# EAGLE design hand amptrol ver4 (EAGLE 7.1.0)
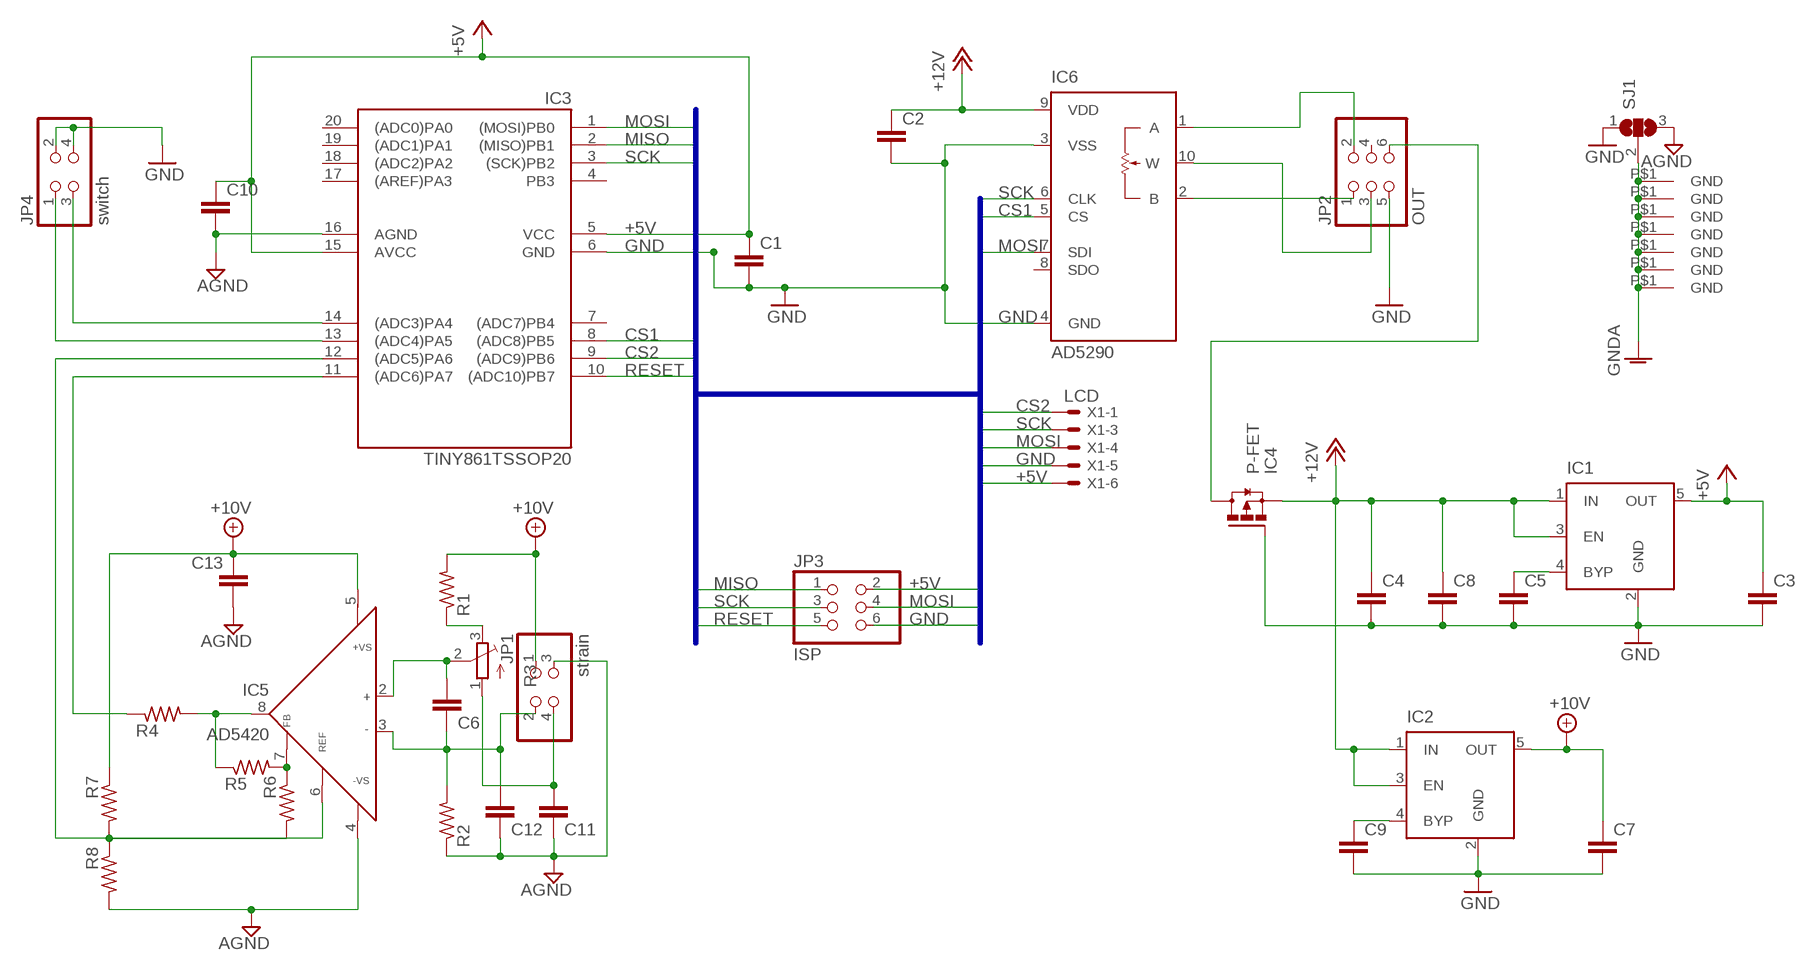
[diagram p0: schematic, sheet 1]

## Parts
C1  C-EUC0603  [C0603]
C2  C-EUC0603  [C0603]
C3  C-EUC0603  [C0603]
C4  C-EUC1206  [C1206]
C5  C-EUC0603  [C0603]
C6  C-EUC0603  [C0603]
C7  C-EUC0603  [C0603]
C8  C-EUC0603  [C0603]
C9  C-EUC0603  [C0603]
C10  C-EUC0603  [C0603]
C11  C-EUC0603  [C0603]
C12  C-EUC0603  [C0603]
C13  C-EUC0603  [C0603]
IC1  MIC5219XX  [SOT23-5]
IC2  MIC5219XX  [SOT23-5]
IC3  TINY861TSSOP20  [TSSOP20]
IC4  P-FET  [SOT23]
IC5  AD5420  [MSOP08]
IC6  AD5290  [MSOP10]
JP1  strain  PINHD-2X2  [2X02]
JP2  OUT  PINHD-2X3  [2X03]
JP3  ISP  PINHD-2X3  [2X03]
JP4  switch  PINHD-2X2  [2X02]
R1  R-US_R0603  [R0603]
R2  R-US_R0603  [R0603]
R3  TRIM_EU-3223W  [3223W]
R4  R-US_R0603  [R0603]
R5  R-US_R0603  [R0603]
R6  R-US_R0603  [R0603]
R7  R-US_R0603  [R0603]
R8  R-US_R0603  [R0603]
SJ1  SJ2W  [SJ_2]
U$5  GRDSMALL  [GNDSMALL]
U$6  GRDSMALL  [GNDSMALL]
U$7  GRDSMALL  [GNDSMALL]
U$8  GRDSMALL  [GNDSMALL]
U$9  GRDSMALL  [GNDSMALL]
U$10  GRDSMALL  [GNDSMALL]
U$11  GRDSMALL  [GNDSMALL]
X1  LCD  22-23-2061  [22-23-2061]

## Nets
+5V: C1.1 C3.1 C10.1 IC1.5(OUT) IC3.5(VCC) IC3.15(AVCC) JP3.2 X1.6
+10V: C7.1 C13.1 IC2.5(OUT) IC5.5(+VS) JP1.1 R1.2 R7.1
+12V: C2.1 C4.1 C8.1 IC1.1(IN) IC1.3(EN) IC2.1(IN) IC2.3(EN) IC4.2(S) IC6.9(VDD)
+12VIN: IC4.3(D) JP2.6
AGND: C10.2 C11.1 C12.1 C13.2 IC3.16(AGND) IC5.4(-VS) JP1.3 R2.1 R8.2 SJ1.3
CS1: IC3.8((ADC8)PB5) IC6.5(CS)
CS2: IC3.9((ADC9)PB6) X1.1
GND: C1.2 C2.2 C3.2 C4.2 C5.2 C7.2 C8.2 C9.2 IC1.2(GND) IC2.2(GND) IC3.6(GND) IC4.1(G) IC6.3(VSS) IC6.4(GND) JP2.5 JP3.6 JP4.2 JP4.4 SJ1.1 X1.5
GNDA: SJ1.2 U$5.P$1(GND) U$6.P$1(GND) U$7.P$1(GND) U$8.P$1(GND) U$9.P$1(GND) U$10.P$1(GND) U$11.P$1(GND)
MISO: IC3.2((MISO)PB1) JP3.1
MOSI: IC3.1((MOSI)PB0) IC6.7(SDI) JP3.4 X1.4
N$1: R1.1 R3.3(E)
N$2: IC3.11((ADC6)PA7) R4.1
N$3: IC6.2(B) JP2.1
N$4: C5.1 IC1.4(BYP)
N$5: C9.1 IC2.4(BYP)
N$6: IC3.13((ADC4)PA5) JP4.1
N$7: IC6.1(A) JP2.2
N$9: IC6.10(W) JP2.3
N$10: C6.2 IC5.2(IN+) R3.2(S)
N$11: IC3.14((ADC3)PA4) JP4.3
N$15: IC5.8(OUT) R4.2 R5.1
N$17: IC5.7(FB) R5.2 R6.1
N$18: IC3.12((ADC5)PA6) IC5.6(REF) R6.2 R7.2 R8.1
RESET: IC3.10((ADC10)PB7) JP3.5
SCK: IC3.3((SCK)PB2) IC6.6(CLK) JP3.3 X1.3
STRAIN+: C6.1 C12.2 IC5.3(IN-) JP1.2 R2.2
STRAIN-: C11.2 JP1.4 R3.1(A)
Unconnected: IC3.4(PB3) IC3.7((ADC7)PB4) IC3.17((AREF)PA3) IC3.18((ADC2)PA2) IC3.19((ADC1)PA1) IC3.20((ADC0)PA0) IC6.8(SDO) JP2.4 X1.2

## Buses
ISP:MOSI,MISO,SCK,RESET,+5V,GND,CS1,CS2

## Library data of the parts
C1-C13 = resistor:C-EU: CAPACITOR, European symbol; SPICEPREFIX: C
IC1 IC2 = v-reg-micrel:MIC5219XX: VOLTAGE REGULATOR; OC_FARNELL: unknown; OC_NEWARK: unknown
IC3 = atmel:TINY861
IC4 = transistor-power:P-FET
IC5 = analog-devices:AD5420
IC6 = analog-devices:AD5290
JP1 JP4 = pinhead:PINHD-2X2: PIN HEADER
JP2 JP3 = pinhead:PINHD-2X3: PIN HEADER
R1 R2 R4-R8 = resistor:R-US_: RESISTOR, American symbol
R3 = pot:TRIM_EU-: POTENTIOMETER
SJ1 = jumper:SJ2W: SMD solder JUMPER
U$5-U$11 = jumper:GRDSMALL
X1 = con-molex:22-23-2061: .100" (2.54mm) Center Header - 6 Pin; MF: MOLEX; MPN: 22-23-2061; OC_FARNELL: 1462922; OC_NEWARK: 27C1933

## Board
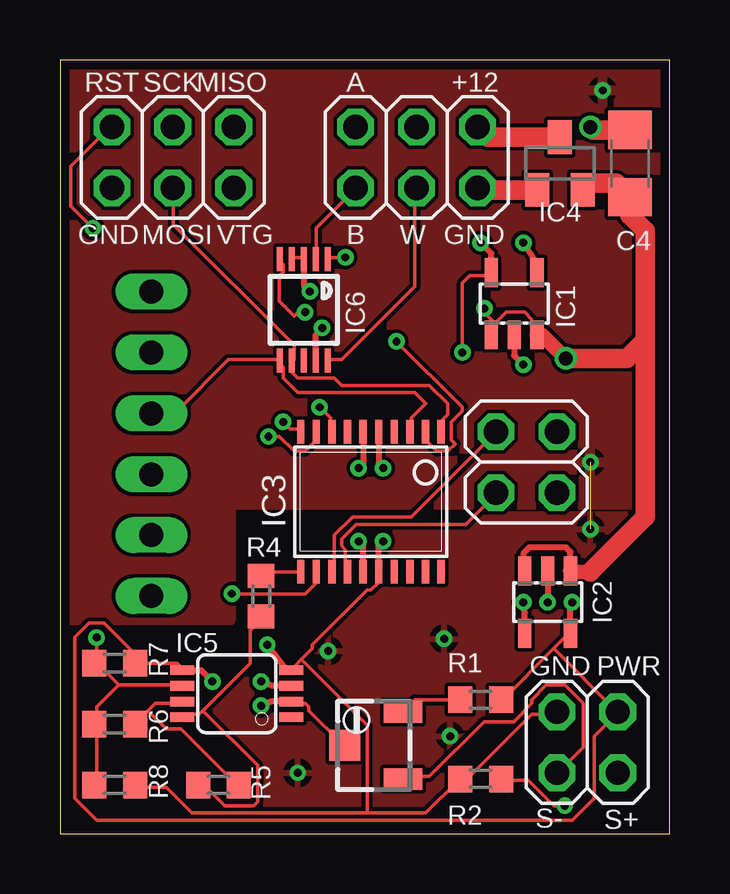
[diagram p1: board, top side]
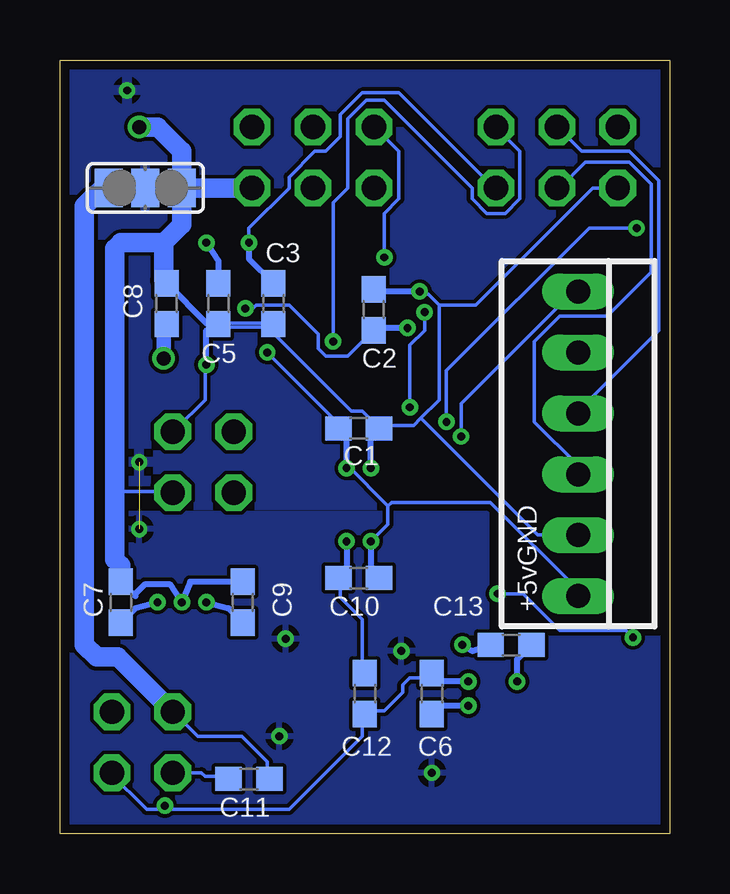
[diagram p2: board, bottom side, seen from below]

Size 25.4 x 32.26 mm. Coordinates in mm from the lower left corner, seen from the top.
Outline: 0,0 25.4,0 25.4,32.26 0,32.26 0,0
Copper layers (1*16): Top 0.0356mm / dielectric 1.5011mm / Bottom 0.0356mm
Design rules "LaenPCBOrder": minimum track width 6mil, minimum drill 13mil, track to track 6mil, track to pad 6mil, pad to pad 6mil, via to via 6mil, smd to smd 6mil, copper to edge 15mil, drill to drill 6mil, minimum pad ring 7mil, minimum via ring 7mil, stop-mask expansion 3mil, vias tented up to drill 0mil, thermal gap 10mil

### Footprints (pad centres in the part's own frame; a part is rotated, then mirrored left to right if it is on the bottom)
C0603 = smd 1.1 x 1: 1 -0.85,0; 2 0.85,0
C1206 = smd 1.6 x 1.8: 1 -1.4,0; 2 1.4,0
SOT23-5 = smd 0.55 x 1.2: 1 -0.95,-1.3; 2 0,-1.3; 3 0.95,-1.3; 4 0.95,1.3; 5 -0.95,1.3
TSSOP20 = smd 0.305 x 0.991: 1 -2.925,-2.918; 2 -2.275,-2.918; 3 -1.625,-2.918; 4 -0.975,-2.918; 5 -0.325,-2.918; 6 0.325,-2.918; 7 0.975,-2.918; 8 1.625,-2.918; 9 2.275,-2.918; 10 2.925,-2.918; 11 2.925,2.918; 12 2.275,2.918; 13 1.625,2.918; 14 0.975,2.918; 15 0.325,2.918; 16 -0.325,2.918; 17 -0.975,2.918; 18 -1.625,2.918; 19 -2.275,2.918; 20 -2.925,2.918
SOT23 = smd 1 x 1.4: 1 -0.95,-1.1; 2 0.95,-1.1; 3 0,1.1
MSOP08 = smd 0.4 x 1: 1 -0.976,-2.263; 2 -0.326,-2.263; 3 0.324,-2.263; 4 0.974,-2.263; 5 0.974,2.262; 6 0.324,2.262; 7 -0.326,2.262; 8 -0.976,2.262
MSOP10 = smd 0.25 x 1: 1 -1,-2.113; 2 -0.5,-2.113; 3 0,-2.113; 4 0.5,-2.113; 5 1,-2.113; 6 1,2.113; 7 0.5,2.113; 8 0,2.113; 9 -0.5,2.113; 10 -1,2.113
2X02 = drill 1.016 octagon: 1 -1.27,-1.27; 2 -1.27,1.27; 3 1.27,-1.27; 4 1.27,1.27
2X03 = drill 1.016 octagon: 1 -2.54,-1.27; 2 -2.54,1.27; 3 0,-1.27; 4 0,1.27; 5 2.54,-1.27; 6 2.54,1.27
R0603 = smd 1 x 1.1: 1 -0.85,0; 2 0.85,0
3223W = smd 0.9 x 1.6: 1 -1.4,-1.215; 3 1.4,-1.215 | smd 1.3 x 1.3: 2 0,1.215
SJ_2 = smd 1.168 x 1.6: 1 -1.524,0; 2 0,0; 3 1.524,0
GNDSMALL = drill 0.33 pad 0.508: P$1 0,0
22-23-2061 = drill 1 long: 1 -6.35,0; 2 -3.81,0; 3 -1.27,0; 4 1.27,0; 5 3.81,0; 6 6.35,0

### Placement (x,y rotation side)
C1  12.95,16.89 0 bottom
C2  12.32,21.84 90 bottom
C3  16.51,22.1 270 bottom
C4  23.75,27.94 90 top
C5  18.8,22.1 270 bottom
C6  9.91,5.84 270 bottom
C7  22.86,9.65 90 bottom
C8  20.95,22.1 90 bottom
C9  17.78,9.65 90 bottom
C10  12.95,10.67 180 bottom
C11  17.53,2.29 180 bottom
C12  12.7,5.84 270 bottom
C13  6.6,7.87 180 bottom
IC1  18.92,22.1 0 top
IC2  20.32,9.65 180 top
IC3  12.95,13.84 180 top
IC4  20.83,27.94 0 top
IC5  7.37,5.84 90 top
IC6  10.16,21.84 180 top
JP1  21.97,3.81 180 top
JP2  14.86,28.19 0 top
JP3  4.7,28.19 180 top
JP4  19.43,15.49 270 top
R1  17.53,5.59 0 top
R2  17.53,2.29 0 top
R3  13.08,3.68 90 top
R4  8.38,9.91 270 top
R5  6.6,2.03 0 top
R6  2.29,4.57 180 top
R7  2.29,7.11 180 top
R8  2.29,2.03 0 top
SJ1  21.84,26.92 180 bottom
U$5  22.61,30.99 0 top
U$6  22.1,15.49 0 top
U$7  22.1,12.7 0 top
U$8  16.26,4.06 0 top
U$9  11.18,7.62 0 top
U$10  16,8.13 0 top
U$11  9.91,2.54 0 top
X1  3.81,16.26 270 bottom

### Tracks (layer width: path | path; a pad name or v marks a point on that pad's centre or on a via)
+5V  (via drill 0.33)
  Top 0.152: v16.76,20.07 16.76,22.96 17.07,23.27 17.83,23.27 IC1.5
  Top 0.254: IC1.5 17.97,24.19 v17.53,24.64 | IC3.5 13.28,15.42 v13.46,15.24 | IC3.15 12.63,12.01 v12.45,12.19
  Bottom 0.152: v17.53,24.64 17.53,25.25 15.85,26.92 15.85,27.38 14.78,28.45 14.33,28.45 13.72,29.06 13.72,29.97 12.8,30.89 11.28,30.89 7.32,26.92 JP3.2 | v12.45,12.19 11.73,12.9 11.73,13.66 | 11.73,13.66 13.41,15.34 v13.46,15.24 | 11.73,13.66 11.58,13.82 7.47,13.82 3.81,10.16 X1.6 | v16.76,20.07 13.72,17.02 C1.1
  Bottom 0.254: v17.53,24.64 17.53,23.96 C3.1 | v13.46,15.24 13.46,16.55 C1.1 | v12.45,12.19 12.45,11.01 C10.1
+10V  (via drill 0.33)
  Top 0.152: 20.57,7.72 21.18,8.33 IC2.5 | 20.57,7.72 18.44,5.59 R1.2 | IC5.5 5.03,6.96 4.88,7.11 R7.1 3.05,7.11 3.05,7.57 1.83,8.79 1.22,8.79 0.61,8.18 0.61,1.47 1.52,0.56 21.34,0.56 22.25,1.47 22.25,4.06 23.16,4.98 JP1.1 23.16,5.13 20.57,7.72
  Top 0.254: IC2.5 21.27,9.33 v21.34,9.65 | IC5.5 5.88,6.82 v6.35,6.35
  Bottom 0.254: v21.34,9.65 22.26,9.4 C7.1 | v6.35,6.35 6.35,7.28 C13.1
+12V  (via drill 0.33, 0.58)
  Top 0.152: 18.14,21.29 18.59,21.74 19.36,21.74 19.66,21.44 19.66,20.98 IC1.3 | 18.14,21.29 17.98,21.13 17.98,20.83 IC1.1 18.14,21.29 | 18.14,21.29 17.83,21.59 17.83,21.74 v17.68,21.89
  Top 0.254: IC2.1 21.27,11.75 21.08,11.94 19.56,11.94 19.3,11.68 19.3,11.02 IC2.3 | IC6.9 10.66,20.82 v10.92,21.08
  Top 0.61: IC1.3 20.1,20.8 v21.08,19.81 | 22.1,10.92 21.3,10.92 IC2.1
  Top 0.813: IC4.2 21.78,27.11 23.17,27.11 C4.1 23.75,25.78 24.38,25.15 24.38,20.57 | 24.38,20.57 24.38,13.21 22.1,10.92 | 24.38,20.57 23.62,19.81 v21.08,19.81
  Bottom 0.152: v17.68,21.89 17.37,21.89 17.22,22.05 15.85,22.05 14.63,20.83 14.63,20.22 14.33,19.91 13.41,19.91 12.34,20.98 C2.1
  Bottom 0.254: v10.92,21.08 12.23,21.08 C2.1
  Bottom 0.61: v21.08,19.81 21.08,21.12 C8.1
+12VIN
  Top 0.813: IC4.3 17.82,29.04 JP2.6
AGND  (via drill 0.33)
  Top 0.152: 10.06,7.26 10.52,7.72 10.52,7.87 12.8,10.16 12.95,10.16 13.26,10.46 13.26,10.92 IC3.16 | 10.06,7.26 9.75,6.96 IC5.4 | 12.8,0.86 15.24,0.86 16.61,2.23 C11.1 16.76,2.39 17.07,2.39 19.66,4.98 20.57,4.98 JP1.3 | 12.8,0.86 5.49,0.86 4.42,1.93 3.2,1.93 R8.2 | 10.06,7.26 12.8,4.52 12.8,0.86
  Top 0.254: IC3.16 13.28,12.01 v13.46,12.19 | IC5.4 9.44,6.82 v8.64,7.87
  Bottom 0.152: C12.1 12.8,6.81 12.8,8.94 13.72,9.86 13.72,10.62 C10.2 | C11.1 16.76,2.39 16.76,3 17.83,4.06 19.66,4.06 20.42,4.83 JP1.3
  Bottom 0.254: v13.46,12.19 13.46,11.01 C10.2 | v8.64,7.87 8.22,7.62 C13.2
  Bottom 0.813: SJ1.3 23.62,26.92 24.38,26.16 24.38,7.87 23.88,7.37 22.99,7.37 JP1.3
CS1  (via drill 0.33)
  Top 0.152: v10.82,17.78 11.28,17.32 11.28,16.87 IC3.8 | v10.21,21.74 10.06,21.89 9.75,21.59 9.14,22.2 9.14,23.27 9.3,23.42 9.3,23.72 9.14,23.88 IC6.5
  Bottom 0.152: v10.82,17.78 10.82,20.37 10.21,20.98 v10.21,21.74
CS2  (via drill 0.33)
  Top 0.152: v8.69,16.56 9.14,16.56 9.75,15.95 10.21,15.95 10.67,16.41 10.67,16.71 IC3.9
  Bottom 0.152: v8.69,16.56 8.69,17.93 4.12,22.5 3.81,22.5 X1.1
GND  (via drill 0.33, 0.58)
  Top 0.152: IC6.4 9.75,24.03 10.06,24.03 IC6.3
  Top 0.254: IC2.2 v20.32,9.65 | IC1.2 18.92,19.94 v19.3,19.56 | IC6.3 10.16,22.86 v10.41,22.61 | IC3.6 12.63,15.42 v12.45,15.24
  Top 0.813: C4.2 22.22,29.34 v22.1,29.46 | IC4.1 17.48,26.84 JP2.5
  Bottom 0.152: C3.2 16.61,21.29 18.75,21.29 C5.2 18.75,21.13 16.76,21.13 13.26,17.63 12.8,17.63 12.19,17.02 C1.2 12.04,17.02 10.67,17.02 10.36,17.32 | v19.3,19.56 19.36,19.46 19.36,18.09 20.57,16.87 JP4.2 | 23.11,14.28 20.73,14.28 JP4.4 | 9.6,22.05 10.06,22.5 10.36,22.5 v10.41,22.61 | 9.6,22.05 9.6,18.09 10.36,17.32 | X1.5 5.49,12.45 10.36,17.32 | JP3.6 3.2,26.92 8.08,22.05 9.6,22.05
  Bottom 0.254: C7.2 22.26,9.91 22.26,9.99 21.84,10.41 20.83,10.41 v20.32,9.65 19.98,10.5 C9.2 | v19.3,19.56 19.3,20.99 C5.2 19.25,21.25 C8.2 | v10.41,22.61 12.23,22.61 C2.2 | v12.45,15.24 12.45,16.55 C1.2
  Bottom 0.813: v22.1,29.46 21.34,29.46 20.32,28.45 SJ1.1 | SJ1.1 JP2.5 | SJ1.1 20.32,25.4 21.08,24.64 | 21.08,24.64 22.86,24.64 23.11,24.38 23.11,14.28 23.11,11.43 22.86,11.18 C7.2 | 21.08,24.64 21.08,23.07 C8.2
GNDA  (1 unrouted)
  pour Bottom: 0,32.26 25.4,32.26 25.4,13.72 7.11,13.72 7.11,8.89 0,8.89
  pour Top: 0,32.26 25.4,32.26 25.4,13.72 7.11,13.72 7.11,8.89 0,8.89
  pour Top: 0,8.13 7.62,8.13 7.62,13.34 25.4,13.34 25.4,0.25 0,0.25
  pour Bottom: 0,8.13 7.62,8.13 7.62,13.34 25.4,13.34 25.4,0.25 0,0.25
MISO  (via drill 0.33)
  Top 0.152: v14.02,20.52 16.76,17.78 16.76,17.63 16.31,17.17 16.31,16.41 16.46,16.26 16.15,15.95 15.7,15.95 15.24,16.41 15.24,16.71 IC3.2
  Bottom 0.152: v14.02,20.52 14.02,26.31 13.41,26.92 13.41,29.82 12.65,30.58 11.89,30.58 8.23,26.92 8.23,26.47 7.62,25.86 6.86,25.86 6.25,26.47 6.25,28.45 7.16,29.36 JP3.1
MOSI
  Top 0.152: IC3.1 15.85,16.87 15.85,17.17 16.15,17.48 16.15,17.93 15.39,18.69 11.73,18.69 11.43,19 9.91,19 9.6,19.3 9.6,19.61 IC6.7 9.75,19.76 9.75,20.37 4.72,25.4 4.72,26.92 JP3.4
  Bottom 0.152: X1.4 3.81,15.34 5.64,17.17 5.64,20.52 4.57,21.59 2.59,21.59 0.76,23.42 0.76,27.08 1.68,27.99 3.5,27.99 4.57,26.92 JP3.4
N$1
  Top 0.152: R1.1 14.78,5.59 14.33,5.13 R3.3
N$2
  Top 0.152: IC3.11 9.91,10.92 8.53,10.92 R4.1
N$3
  Top 0.152: IC6.2 10.67,24.03 10.67,25.25 12.34,26.92 JP2.1
N$4  (via drill 0.33)
  Top 0.254: IC1.4 19.87,23.82 v19.3,24.64
  Bottom 0.254: v19.3,24.64 18.8,23.88 C5.1
N$5  (via drill 0.33)
  Top 0.254: IC2.4 19.37,9.21 v19.3,9.65
  Bottom 0.254: v19.3,9.65 18.38,9.4 C9.1
N$6
  Top 0.152: IC3.13 11.43,11.07 11.43,12.45 12.19,13.21 14.63,13.21 18.14,16.71 JP4.1
N$7  (via drill 0.33)
  Top 0.152: v11.89,24.03 11.28,24.03 IC6.1
  Bottom 0.152: v11.89,24.03 11.89,25.86 11.28,26.47 11.28,28.45 12.19,29.36 JP2.2
N$9
  Top 0.152: IC6.10 11.28,19.76 11.73,19.76 14.78,22.81 14.78,26.92 JP2.3
N$10  (via drill 0.33)
  Top 0.152: R3.2 11.73,3.76 10.36,5.13 10.36,5.28 10.21,5.44 9.75,5.44 IC5.2
  Top 0.254: IC5.2 8.82,5.52 v8.38,5.33
  Bottom 0.254: v8.38,5.33 9.56,5.33 C6.2
N$11
  Top 0.152: IC3.14 11.89,11.07 11.89,11.84 11.73,11.99 11.73,12.29 12.34,12.9 16.92,12.9 18.14,14.12 JP4.3
N$15
  Top 0.152: 5.94,5.13 7.92,7.11 7.92,8.48 8.38,8.94 R4.2 | 5.94,5.13 5.79,4.98 5.18,4.98 IC5.8 | 5.94,5.13 8.23,2.85 8.23,1.32 8.08,1.17 6.86,1.17 6.1,1.93 5.79,1.93 R5.1
N$17
  Top 0.152: 5.18,5.59 IC5.7 5.03,5.44 3.96,5.44 3.66,5.13 | 3.66,5.13 3.2,4.67 R6.1 | 3.66,5.13 4.42,4.37 5.03,4.37 7.32,2.08 R5.2
N$18  (via drill 0.33)
  Top 0.152: R8.1 1.52,2.08 1.52,4.52 R6.2 1.52,4.67 1.52,5.28 2.44,6.2 | v7.16,10.01 10.21,10.01 10.67,10.46 10.67,10.92 IC3.12 | 1.52,7.11 v1.52,8.18 | 2.44,6.2 5.03,6.2 IC5.6 | 1.52,7.11 2.44,6.2 | 1.52,7.11 R7.2
  Bottom 0.152: v7.16,10.01 6.1,10.01 4.57,8.48 1.83,8.48 v1.52,8.18
RESET  (via drill 0.33)
  Top 0.152: v9.3,17.17 9.6,16.87 9.91,16.87 IC3.10 | v1.37,25.25 0.46,26.16 0.46,27.84 2.13,29.52 JP3.5
  Bottom 0.152: v9.3,17.17 9.3,19.3 3.35,25.25 v1.37,25.25
SCK
  Top 0.152: IC3.3 14.63,16.87 14.63,17.32 15.24,17.93 14.78,18.39 9.91,18.39 9.3,19 9.3,19.46 9.14,19.61 IC6.6 9.14,19.76 7.01,19.76 4.88,17.63 3.81,17.63 X1.3
  Bottom 0.152: X1.3 3.81,17.63 0.46,20.98 0.46,27.23 1.68,28.45 3.66,28.45 4.57,29.36 JP3.3
STRAIN+  (via drill 0.33)
  Top 0.152: v21.03,1.17 20.57,1.17 19.51,2.23 18.44,2.23 R2.2
  Top 0.254: IC5.3 8.82,6.17 v8.38,6.35
  Bottom 0.152: C6.1 9.75,6.5 10.82,6.5 11.12,6.2 11.12,5.89 11.89,5.13 12.65,5.13 C12.2 12.8,4.98 12.8,4.06 15.85,1.02 20.88,1.02 v21.03,1.17 21.18,1.02 21.79,1.02 23.32,2.54 JP1.2
  Bottom 0.254: 9.82,6.6 C6.1 9.56,6.35 v8.38,6.35
STRAIN-
  Top 0.152: R3.1 14.33,2.39 15.39,2.39 17.68,4.67 18.9,4.67 19.66,5.44 19.66,5.59 20.27,6.2 21.03,6.2 21.79,5.44 21.79,3.61 20.73,2.54 JP1.4
  Bottom 0.152: JP1.4 19.51,2.54 19.36,2.39 18.44,2.39 C11.2

### Text on the board
tNames: RST | SCK | MISO | A | +12 | GND | MOSI | VTG | B | W | GND | GND | PWR | S+ | S-
bNames: GND | +5v